# EAGLE design TimerControlV1 (EAGLE 5.11)
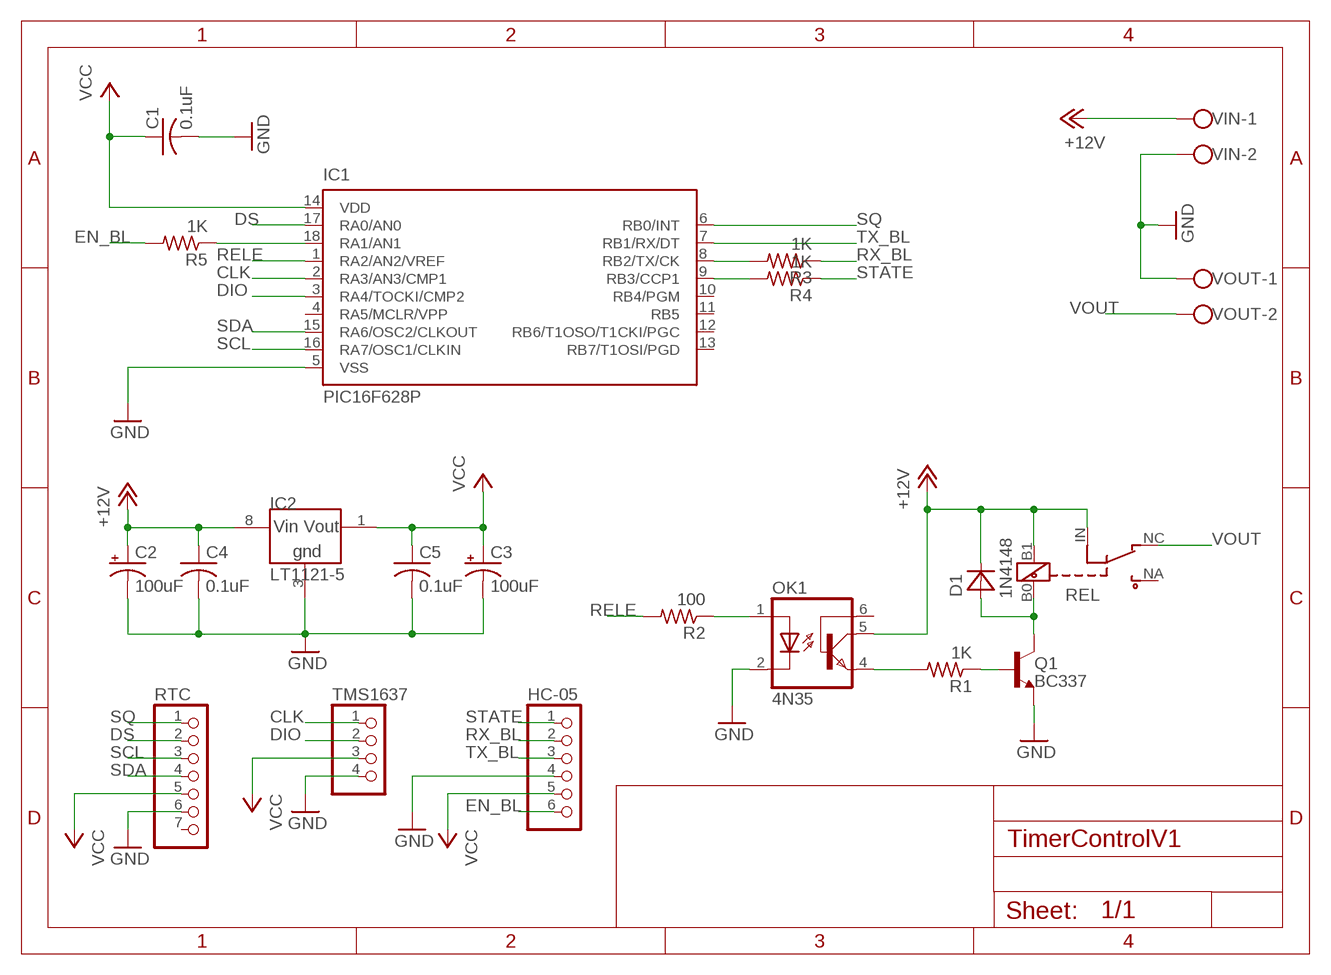
[diagram p0: schematic, sheet 1]

## Parts
C1  0.1uF  C-USC0603  [C0603]
C2  100uF  CPOL-USE  [PANASONIC_E]
C3  100uF  CPOL-USE  [PANASONIC_E]
C4  0.1uF  C-USC0603  [C0603]
C5  0.1uF  C-USC0603  [C0603]
D1  1N4148  DIODE  [DIODE]
HC-05  PINHD-1X6  [1X06]
IC1  PIC16F628P  [DIL18]
IC2  LT1121-5  LT1121  [8SOIC]
OK1  4N35  [DIL06]
Q1  BC337  [TO92]
R1  1K  R-US_R0603  [R0603]
R2  100  R-US_R0603  [R0603]
R3  1K  R-US_R0603  [R0603]
R4  1K  R-US_R0603  [R0603]
R5  1K  R-US_R0603  [R0603]
REL  RELE  [RELE]
RTC  PINHD-1X7  [1X07]
TMS1637  PINHD-1X4  [1X04]
VIN  W237-102  [W237-102]
VOUT  W237-102  [W237-102]

## Nets
+12V: C2.+ C4.1 D1.K IC2.8 OK1.5(COL) REL.B1 REL.IN VIN.1
CLK: IC1.2(RA3/AN3/CMP1) TMS1637.1
DIO: IC1.3(RA4/TOCKI/CMP2) TMS1637.2
DS: IC1.17(RA0/AN0) RTC.2
EN_BL: HC-05.6 R5.2
GND: C1.2 C2.- C3.- C4.2 C5.2 HC-05.4 IC1.5(VSS) IC2.3 OK1.2(C) Q1.E RTC.6 TMS1637.4 VIN.2 VOUT.1
N$1: OK1.4(EMI) R1.2
N$2: OK1.1(A) R2.1
N$3: Q1.B R1.1
N$4: D1.A Q1.C REL.B0
N$10: IC1.9(RB3/CCP1) R4.2
N$11: IC1.18(RA1/AN1) R5.1
RELE: IC1.1(RA2/AN2/VREF) R2.2
RX_BL: HC-05.2 R3.1
SCL: IC1.16(RA7/OSC1/CLKIN) RTC.3
SDA: IC1.15(RA6/OSC2/CLKOUT) RTC.4
SQ: IC1.6(RB0/INT) RTC.1
STATE: HC-05.1 R4.1
TX_BL: HC-05.3 IC1.7(RB1/RX/DT)
TXPIC: IC1.8(RB2/TX/CK) R3.2
VCC: C1.1 C3.+ C5.1 HC-05.5 IC1.14(VDD) IC2.1 RTC.5 TMS1637.3
VOUT: REL.NC VOUT.2
Unconnected: IC1.4(RA5/MCLR/VPP) IC1.10(RB4/PGM) IC1.11(RB5) IC1.12(RB6/T1OSO/T1CKI/PGC) IC1.13(RB7/T1OSI/PGD) OK1.6(BAS) REL.NA RTC.7

## Library data of the parts
C1 C4 C5 = rcl:C-US: CAPACITOR, American symbol
C2 C3 = rcl:CPOL-US: POLARIZED CAPACITOR, American symbol
D1 = Ricardo_Library:DIODE
HC-05 = pinhead:PINHD-1X6: PIN HEADER
IC1 = microchip:PIC16F62*: FLASH-Based 8-Bit CMOS Microcontroller Source: http://ww1.microchip.com/downloads/en/DeviceDoc/40300C.pdf; MF: MICROCHIP; MPN: PIC16F628-04I/P; OC_FARNELL: 9760407; OC_NEWARK: 19C7272
IC2 = magnetometro:LT1121
OK1 = optocoupler:4N35: MOTOROLA OPTO COUPLER; MF: FAIRCHILD SEMICONDUCTOR; MPN: 4N35; OC_FARNELL: 1328375; OC_NEWARK: 72K9946
Q1 = Ricardo_Library:BC337
R1-R5 = rcl:R-US_: RESISTOR, American symbol
REL = Ricardo_Library:RELE
RTC = pinhead:PINHD-1X7: PIN HEADER
TMS1637 = pinhead:PINHD-1X4: PIN HEADER
VIN VOUT = con-wago-500:W237-102: WAGO SCREW CLAMP; MPN: 237-102; OC_FARNELL: unknown; OC_NEWARK: 70K9898

## Board
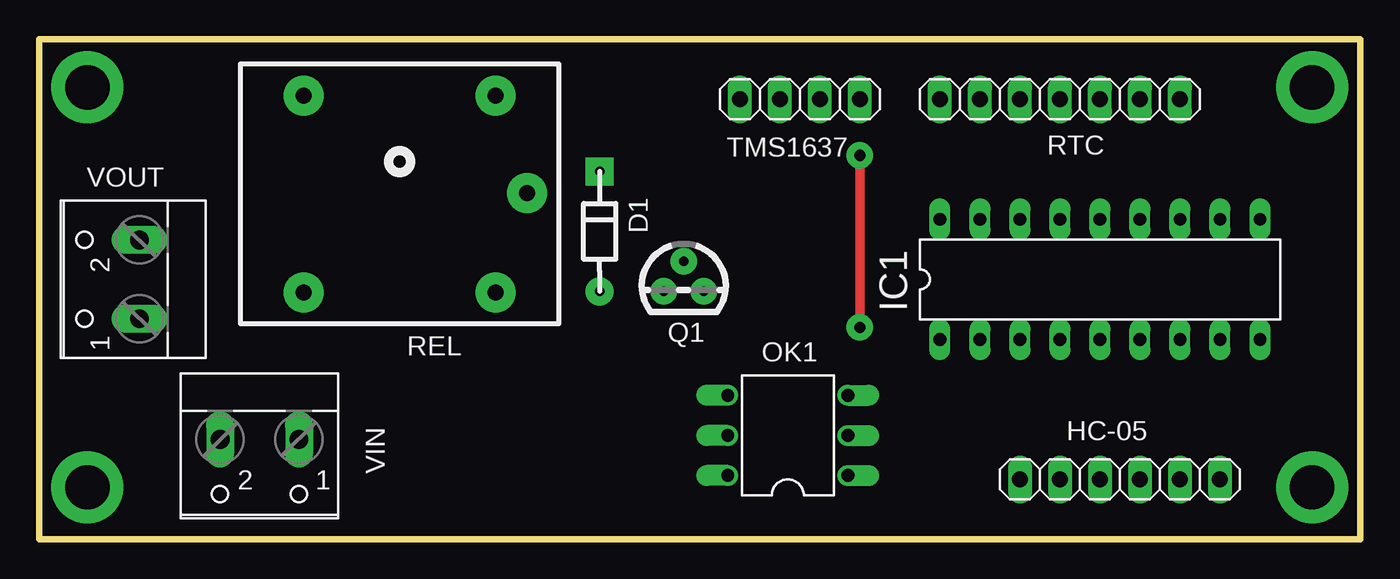
[diagram p1: board, top side]
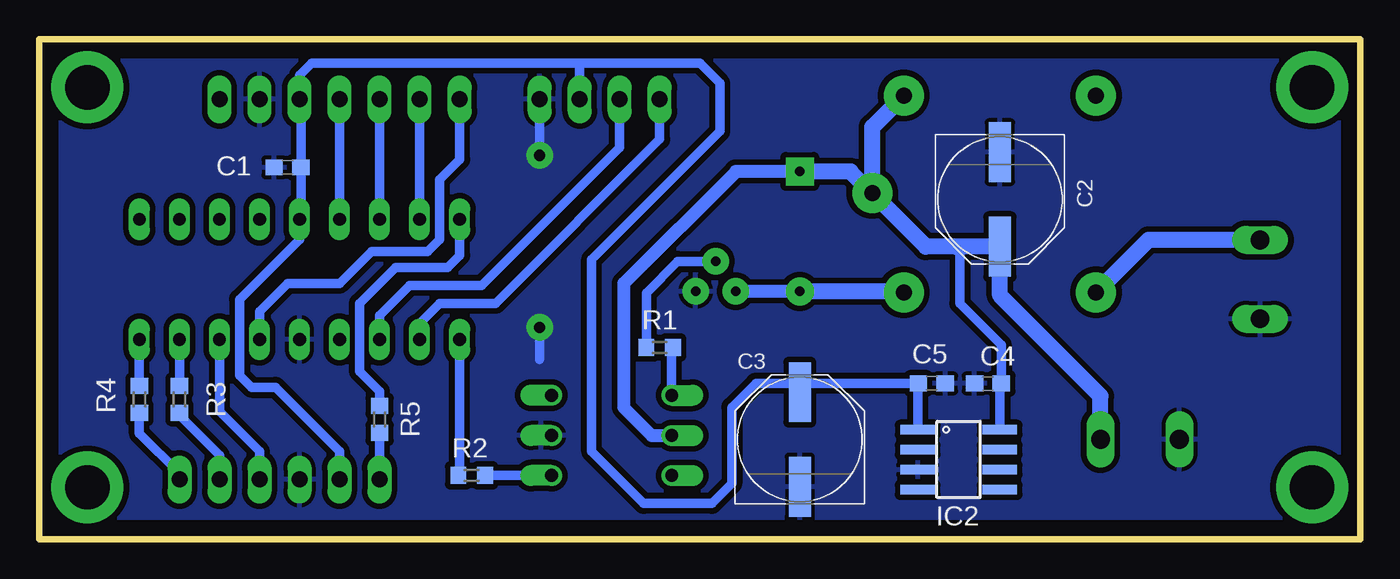
[diagram p2: board, bottom side, seen from below]

Size 83.82 x 31.75 mm. Coordinates in mm from the lower left corner, seen from the top.
Outline: 0,0 0,31.75 83.82,31.75 83.82,0 0,0
Copper layers (1*16): Top 0.035mm / dielectric 1.5mm / Bottom 0.035mm
Design rules "default": minimum track width 10mil, minimum drill 24mil, track to track 8mil, track to pad 8mil, pad to pad 8mil, via to via 8mil, smd to smd 8mil, copper to edge 40mil, drill to drill 8mil, minimum pad ring 10mil, minimum via ring 8mil, stop-mask expansion 4mil, vias tented up to drill 0mil, thermal gap 10mil

### Footprints (pad centres in the part's own frame; a part is rotated, then mirrored left to right if it is on the bottom)
C0603 = smd 1.1 x 1: 1 -0.85,0; 2 0.85,0
PANASONIC_E = smd 3.8 x 1.4: + 3,0; - -3,0
DIODE = drill 0.61 pad 1.778 round: A -3.81,0 | drill 0.61 pad 1.778 square: K 3.81,0
1X06 = drill 1.016 long: 1 -6.35,0; 2 -3.81,0; 3 -1.27,0; 4 1.27,0; 5 3.81,0; 6 6.35,0
DIL18 = drill 0.813 long: 1 -10.16,-3.81; 2 -7.62,-3.81; 3 -5.08,-3.81; 4 -2.54,-3.81; 5 0,-3.81; 6 2.54,-3.81; 7 5.08,-3.81; 8 7.62,-3.81; 9 10.16,-3.81; 10 10.16,3.81; 11 7.62,3.81; 12 5.08,3.81; 13 2.54,3.81; 14 0,3.81; 15 -2.54,3.81; 16 -5.08,3.81; 17 -7.62,3.81; 18 -10.16,3.81
8SOIC = smd 0.6 x 2.2: 1 -1.88,-2.676; 2 -0.61,-2.676; 3 0.66,-2.676; 4 1.93,-2.676; 5 1.93,2.524; 6 0.66,2.524; 7 -0.61,2.524; 8 -1.88,2.524
DIL06 = drill 0.813 offset: 1 -2.54,-3.81; 2 0,-3.81; 3 2.54,-3.81; 4 2.54,3.81; 5 0,3.81; 6 -2.54,3.81
TO92 = drill 0.61 pad 1.676 round: B 0,1.905; C -1.27,0; E 1.27,0
R0603 = smd 1 x 1.1: 1 -0.85,0; 2 0.85,0
RELE = drill 1.016 pad 2.54 round: B0 -6.1,5.9; B1 -6.1,-6.6; IN -8.1,-0.4; NA 6.1,-6.6; NC 6.1,5.9
1X07 = drill 1.016 long: 1 -7.62,0; 2 -5.08,0; 3 -2.54,0; 4 0,0; 5 2.54,0; 6 5.08,0; 7 7.62,0
1X04 = drill 1.016 long: 1 -3.81,0; 2 -1.27,0; 3 1.27,0; 4 3.81,0
W237-102 = drill 1.194 long: 1 -2.5,-1.27; 2 2.5,-1.27

### Placement (x,y rotation side)
C1  68.07,23.62 180 bottom
C2  22.86,21.59 270 bottom
C3  35.56,6.35 90 bottom
C4  23.62,9.91 180 bottom
C5  27.18,9.91 0 bottom
D1  35.56,19.56 90 top
HC-05  68.58,3.81 180 top
IC1  67.31,16.51 0 top
IC2  25.4,5.08 270 bottom
OK1  47.5,6.6 90 top
Q1  40.89,15.75 0 top
R1  44.45,12.19 0 bottom
R2  56.39,4.06 180 bottom
R3  74.93,8.89 90 bottom
R4  77.47,8.89 90 bottom
R5  62.23,7.62 270 bottom
REL  22.86,21.59 180 top
RTC  64.77,27.94 0 top
TMS1637  48.26,27.94 0 top
VIN  13.97,5.08 180 top
VOUT  5.08,16.51 90 top

### Tracks (layer width: path | path; a pad name or v marks a point on that pad's centre or on a via)
+12V
  Bottom 0.406: C4.1 22.88,9.8 | 25.65,18.59 25.4,18.34
  Bottom 0.61: 22.88,9.8 IC2.8 | C4.1 22.77,12.36 25.4,14.99 25.4,18.34
  Bottom 0.813: OK1.5 44.96,6.6 46.74,8.38 46.74,16.26 39.62,23.37 D1.K
  Bottom 1.016: VIN.1 16.47,9.1 22.86,15.49 C2.+ 25.65,18.59 27.56,18.59 REL.IN | REL.IN 32.34,23.37 D1.K | REL.B1 30.96,26.19 REL.IN
CLK
  Bottom 0.61: TMS1637.1 44.45,25.4 54.86,14.99 58.42,14.99 59.69,13.72 IC1.2
DIO
  Bottom 0.61: TMS1637.2 46.99,24.89 55.75,16.13 60.33,16.13 62.23,14.22 IC1.3
DS
  Bottom 0.61: IC1.17 RTC.2
EN_BL
  Bottom 0.61: HC-05.6 R5.2
GND  (via drill 0.7 pad 1.68)
  Top 0.61: v52.07,13.46 v52.07,24.38
  Bottom 0.61: v52.07,24.38 TMS1637.4 | 52.07,11.43 v52.07,13.46
  pour Bottom (isolate 0.356): 0,32 83.82,32 83.82,0 0,0
N$1
  Bottom 0.406: 43.69,12.1 R1.2
  Bottom 0.61: OK1.4 43.69,12.1
N$2
  Bottom 0.61: OK1.1 R2.1
N$3
  Bottom 0.61: Q1.B 43.31,17.65 45.3,15.66 R1.1
N$4
  Bottom 0.406: REL.B0 29.02,15.75
  Bottom 0.813: D1.A Q1.C
  Bottom 1.016: 29.02,15.75 D1.A
N$5  (via drill 2.8 pad 4.57)
  other vias: 3.05,3.3
N$6  (via drill 2.8 pad 4.57)
  other vias: 3.05,28.7
N$7  (via drill 2.8 pad 4.57)
  other vias: 80.77,28.7
N$8  (via drill 2.8 pad 4.57)
  other vias: 80.77,3.3
N$10
  Bottom 0.61: R4.2 IC1.9
N$11
  Bottom 0.61: IC1.18 57.15,18.03 57.91,17.27 61.21,17.27 63.5,14.99 63.5,10.67 62.23,9.4 R5.1
RELE
  Bottom 0.406: R2.2 57.15,4.15
  Bottom 0.61: 57.15,4.15 IC1.1
RX_BL
  Bottom 0.61: R3.1 74.93,7.87 72.39,5.33 HC-05.2
SCL
  Bottom 0.61: IC1.16 RTC.3
SDA
  Bottom 0.61: IC1.15 RTC.4
SQ
  Bottom 0.61: RTC.1 57.15,24.13 58.42,22.86 58.42,19.05 59.18,18.29 62.74,18.29 64.77,16.26 68.07,16.26 69.85,14.48 IC1.6
STATE
  Bottom 0.61: R4.1 77.47,6.73 74.93,4.19 HC-05.1
TX_BL
  Bottom 0.61: IC1.7 72.39,8.13 69.85,5.59 HC-05.3
TXPIC
  Bottom 0.61: R3.2 IC1.8
VCC
  Bottom 0.406: 28.08,9.86 C5.1 | 35,9.91 C3.+
  Bottom 0.61: IC2.1 28.08,9.86 | C5.1 35,9.91 38.35,9.91 39.88,8.38 39.88,3.56 41.15,2.29 45.47,2.29 48.77,5.59 48.77,17.78 40.64,25.91 40.64,28.96 41.91,30.23 49.53,30.23 | HC-05.5 64.77,5.59 68.83,9.65 70.36,9.65 71.12,10.41 71.12,15.24 67.31,19.05 IC1.14 67.22,20.41 C1.1 67.22,27.85 RTC.5 67.31,29.46 66.55,30.23 49.53,30.23 | 49.53,30.23 TMS1637.3
VOUT
  Bottom 1.016: VOUT.2 13.44,19.01 REL.NC